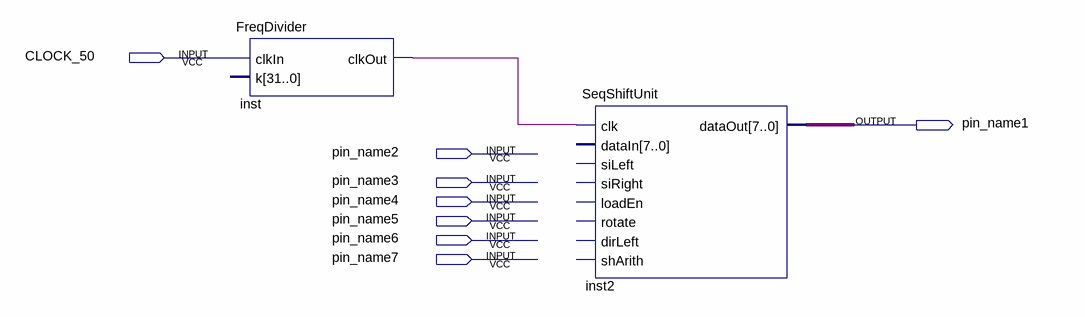
[diagram p0: schematic sheet]
// Quartus schematic SeqShiftUnit_Demo.bdf as structural Verilog: 2 symbols, 8 pins
module SeqShiftUnit_Demo (
  input  CLOCK_50,
  input  pin_name2,
  input  pin_name3,
  input  pin_name4,
  input  pin_name5,
  input  pin_name6,
  input  pin_name7,
  output pin_name1
);

  wire inst_clkout;
  wire [7:0] inst2_dataout;

  FreqDivider inst (.clkIn(CLOCK_50), .clkOut(inst_clkout));  // open: k
  SeqShiftUnit inst2 (
    .clk(inst_clkout), .dataOut(inst2_dataout));  // open: dataIn, siLeft, siRight, loadEn, rotate, dirLeft, shArith
endmodule
